# EAGLE schematic ComplexLEDs copy (EAGLE 9.6.2)
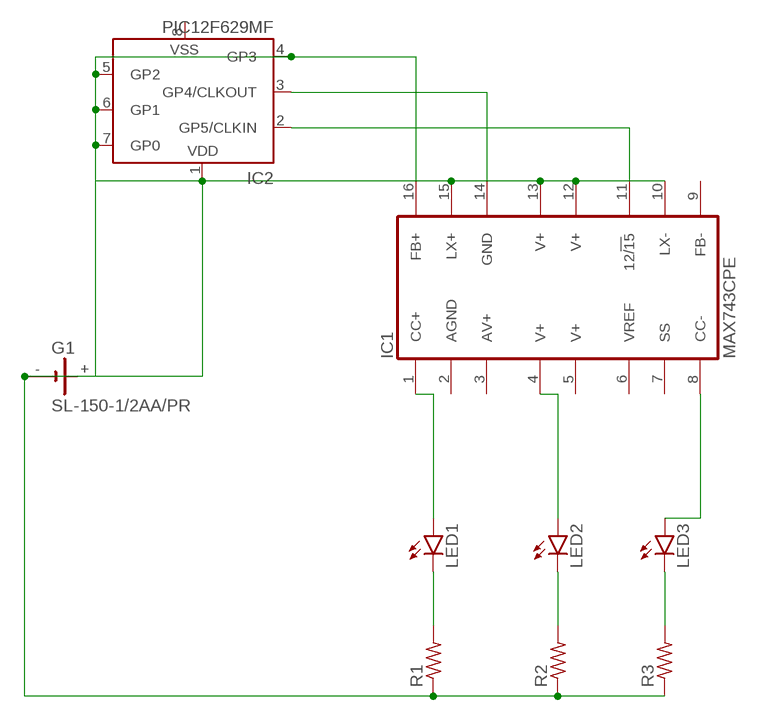
[diagram p0: schematic, sheet 1]

## Parts
G1  SL-150-1/2AA/PR  [SL-150-1/2AA/PR]
IC1  MAX743CPE  [DIL16]
IC2  PIC12F629MF  [DFN-S]
LED1  LED5MM  [LED5MM]
LED2  LED5MM  [LED5MM]
LED3  LED5MM  [LED5MM]
R1  R-US_0309/10  [0309/10]
R2  R-US_0309/10  [0309/10]
R3  R-US_0309/10  [0309/10]

## Nets
N$1: G1.+ G1.- IC1.10(LX-) IC1.12(V+) IC1.13(V+) IC1.15(LX+) IC1.16(FB+) IC2.1(VDD) IC2.4(GP3) IC2.5(GP2) IC2.6(GP1) IC2.7(GP0) R1.1 R2.1 R3.1
N$2: IC1.1(CC+) LED1.A
N$3: LED1.K(C) R1.2
N$5: IC1.4(V+) LED2.A
N$6: LED2.K(C) R2.2
N$7: IC1.8(CC-) LED3.A
N$8: LED3.K(C) R3.2
N$9: IC1.14(GND) IC2.3(GP4/CLKOUT)
N$10: IC1.11(12/15) IC2.2(GP5/CLKIN)
Unconnected: IC1.3(AV+) IC1.5(V+) IC1.6(VREF) IC1.7(SS) IC1.9(FB-)

## Power pins joined to a net without a drawn wire
AGND: IC1.2(AGND)
VSS: IC2.8(VSS)

## Library data of the parts
G1 = battery:SL-150-1/2AA/PR: LI BATTERY Sonnenschein
IC1 = maxim:MAX743CPE: PWM SWITCH-MODE REGULATORr; MF: MAXIM; MPN: MAX743CPE; OC_FARNELL: 1187931; OC_NEWARK: 79C2246
IC2 = microchip:PIC12F6*: Data Sheet 8-Pin FLASH-Based 8-Bit CMOS Microcontrollers Source: http://www.microchip.com .. 41190c.pdf; MF: MICROCHIP; MPN: PIC12F629-I/MD; OC_FARNELL: 1618004; OC_NEWARK: 56K7222
LED1-LED3 = led:LED: LED OSRAM: - CHIPLED LG R971, LG N971, LY N971, LG Q971, LY Q971, LO R971, LY R971 LH N974, LH R974 LS Q976, LO Q976, LY Q976 LO Q996 - Hyper CHIPLED LW Q18S LB Q993, LB Q99A, LB R99A - SideLED LS A670, LO A670, LY A670, LG A670, LP A670 LB A673, LV A673, LT A673, LW A673 LH A674 LY A675 LS A676, LA A676, LO A676, LY A676, LW A676 LS A679, LY A679, LG A679 - Hyper Micro SIDELED® LS Y876, LA Y876, LO Y876, LY Y876 LT Y87S - SmartLED LW L88C, LW L88S LB L89C, LB L89S, LG L890 LS L89K, LO L89K, LY L89K LS L896, LA L896, LO L896, LY L896 - TOPLED LS T670, LO T670, LY T670, LG T670, LP T670 LSG T670, LSP T670, LSY T670, LOP T670, LYG T670 LG T671, LOG T671, LSG T671 LB T673, LV T673, LT T673, LW T673 LH T674 LS T676, LA T676, LO T676, LY T676, LB T676, LH T676, LSB T676, LW T676 LB T67C, LV T67C, LT T67C, LS T67K, LO T67K, LY T67K, LW E67C LS E67B, LA E67B, LO E67B, LY E67B, LB E67C, LV E67C, LT E67C LW T67C LS T679, LY T679, LG T679 LS T770, LO T770, LY T770, LG T770, LP T770 LB T773, LV T773, LT T773, LW T773 LH T774 LS E675, LA E675, LY E675, LS T675 LS T776, LA T776, LO T776, LY T776, LB T776 LHGB T686 LT T68C, LB T68C - Hyper Mini TOPLED® LB M676 - Mini TOPLED Santana® LG M470 LS M47K, LO M47K, LY M47K Source: http://www.osram.convergy.de LUXEON: - LUMILED® LXK2-PW12-R00, LXK2-PW12-S00, LXK2-PW14-U00, LXK2-PW14-V00 LXK2-PM12-R00, LXK2-PM12-S00, LXK2-PM14-U00 LXK2-PE12-Q00, LXK2-PE12-R00, LXK2-PE12-S00, LXK2-PE14-T00, LXK2-PE14-U00 LXK2-PB12-K00, LXK2-PB12-L00, LXK2-PB12-M00, LXK2-PB14-N00, LXK2-PB14-P00, LXK2-PB14-Q00 LXK2-PR12-L00, LXK2-PR12-M00, LXK2-PR14-Q00, LXK2-PR14-R00 LXK2-PD12-Q00, LXK2-PD12-R00, LXK2-PD12-S00 LXK2-PH12-R00, LXK2-PH12-S00 LXK2-PL12-P00, LXK2-PL12-Q00, LXK2-PL12-R00 Source: www.luxeon.com KINGBRIGHT: KA-3528ASYC Source: www.kingbright.com
R1-R3 = rcl:R-US_: RESISTOR, American symbol; SPICEPREFIX: R